# EAGLE design dac single ended 32-2 (EAGLE 4.13)
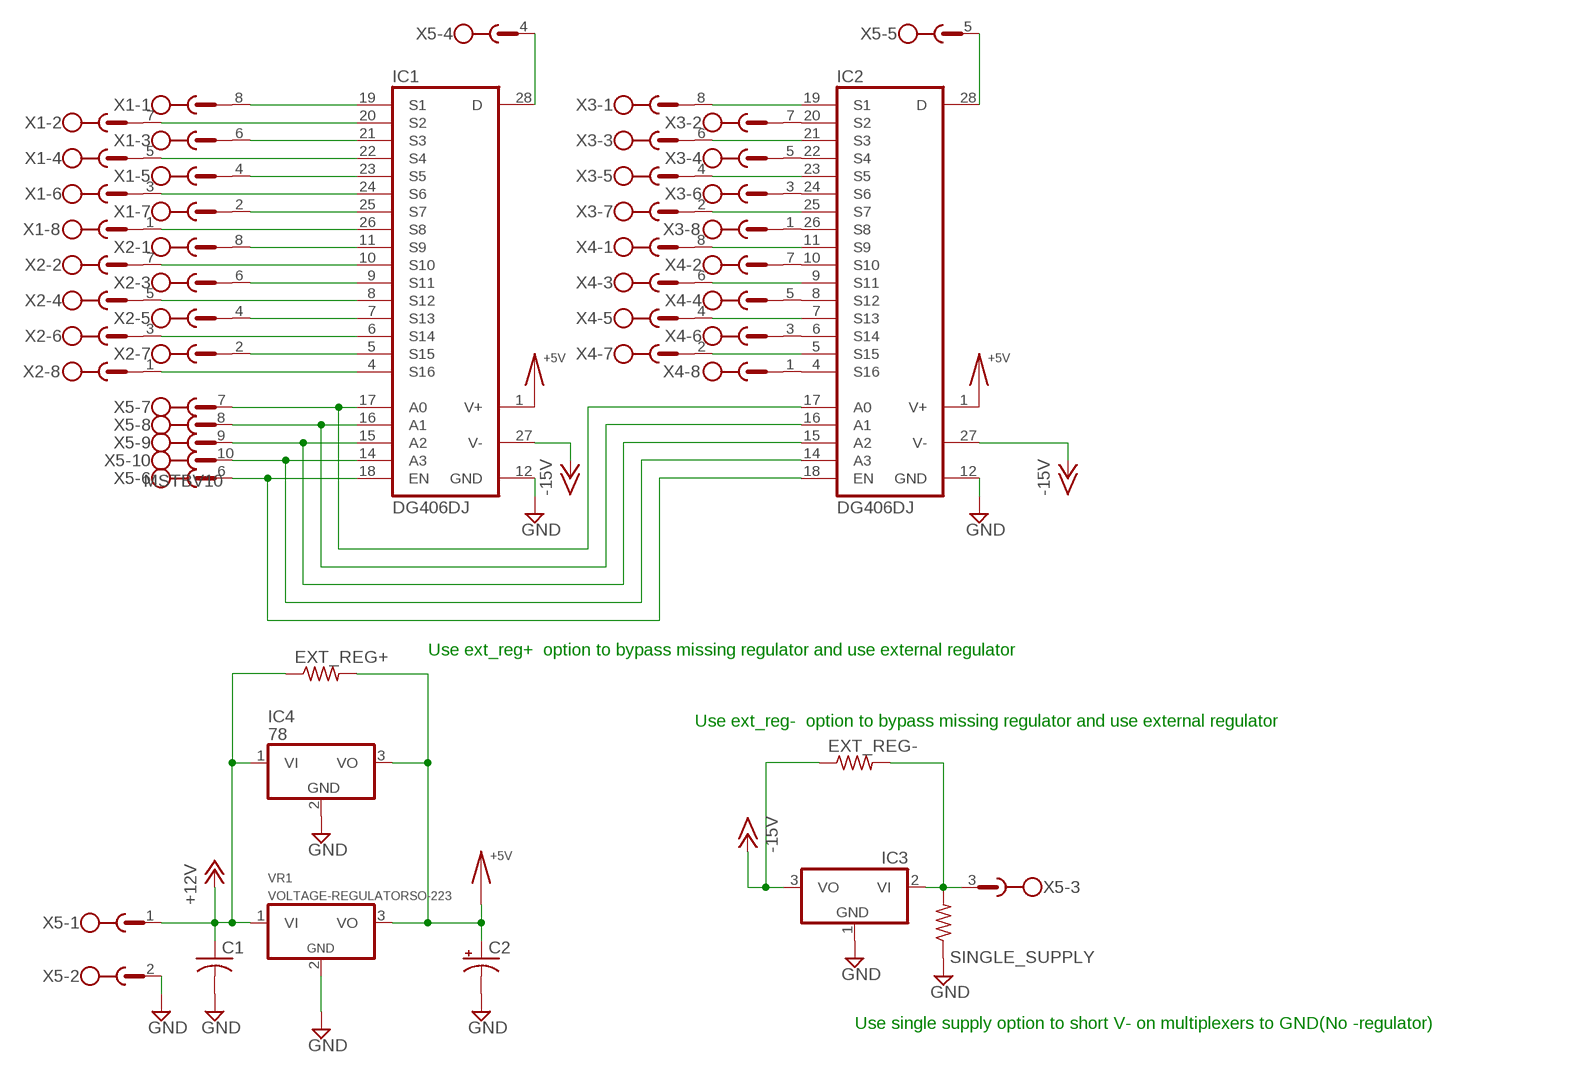
[diagram p0: schematic, sheet 1]

## Parts
C1  CAPACITOR-NO-POLARITYC1210K  [C1210K]
C2  CAPACITOR-ELECTROLYTICG  [PANASONIC_G]
EXT_REG+  RESISITORM1406  [M1406]
EXT_REG-  RESISITORM1406  [M1406]
IC1  DG406DJ  [DIL28-6]
IC2  DG406DJ  [DIL28-6]
IC3  79  [TO220S]
IC4  78  [TO220S]
SINGLE_SUPPLY  RESISITORM1406  [M1406]
VR1  VOLTAGE-REGULATORSO-223  [SOT223R_INFINEON]
X1  MSTBV8  [MSTBV8]
X2  MSTBV8  [MSTBV8]
X3  MSTBV8  [MSTBV8]
X4  MSTBV8  [MSTBV8]
X5  MSTBV10  [MSTBV10]

## Nets
+5V: C2.+ EXT_REG+.2 IC1.1(V+) IC2.1(V+) IC4.3(VO) VR1.3(VO)
+12V: C1.1 EXT_REG+.1 IC4.1(VI) VR1.1(VI) X5.1
-15V: EXT_REG-.1 IC1.27(V-) IC2.27(V-) IC3.3(VO)
GND: C1.2 C2.- IC1.12(GND) IC2.12(GND) IC3.1(GND) IC4.2(GND) SINGLE_SUPPLY.1 VR1.2(GND) X5.2
N$1: IC1.19(S1) X1.8
N$2: IC1.20(S2) X1.7
N$3: IC1.21(S3) X1.6
N$4: IC1.22(S4) X1.5
N$5: IC1.23(S5) X1.4
N$6: IC1.24(S6) X1.3
N$7: IC1.25(S7) X1.2
N$8: IC1.26(S8) X1.1
N$9: IC1.11(S9) X2.8
N$10: IC1.10(S10) X2.7
N$11: IC1.9(S11) X2.6
N$12: IC1.8(S12) X2.5
N$13: IC1.7(S13) X2.4
N$14: IC1.6(S14) X2.3
N$15: IC1.5(S15) X2.2
N$16: IC1.4(S16) X2.1
N$17: IC2.19(S1) X3.8
N$18: IC2.20(S2) X3.7
N$19: IC2.21(S3) X3.6
N$20: IC2.22(S4) X3.5
N$21: IC2.23(S5) X3.4
N$22: IC2.24(S6) X3.3
N$23: IC2.25(S7) X3.2
N$24: IC2.26(S8) X3.1
N$25: IC2.11(S9) X4.8
N$26: IC2.10(S10) X4.7
N$27: IC2.9(S11) X4.6
N$28: IC2.8(S12) X4.5
N$29: IC2.7(S13) X4.4
N$30: IC2.6(S14) X4.3
N$31: IC2.5(S15) X4.2
N$32: IC2.4(S16) X4.1
N$33: IC1.17(A0) IC2.17(A0) X5.7
N$34: IC1.16(A1) IC2.16(A1) X5.8
N$35: IC1.15(A2) IC2.15(A2) X5.9
N$36: IC1.14(A3) IC2.14(A3) X5.10
N$37: IC1.18(EN) IC2.18(EN) X5.6
N$38: IC1.28(D) X5.4
N$39: IC2.28(D) X5.5
N$40: EXT_REG-.2 IC3.2(VI) SINGLE_SUPPLY.2 X5.3

## Notes on the sheet
- Use ext_reg+  option to bypass missing regulator and use external regulator
- Use ext_reg-  option to bypass missing regulator and use external regulator
- Use single supply option to short V- on multiplexers to GND(No -regulator)

## Library data of the parts
C1 = 1 Dan's Common Parts:CAPACITOR-NO-POLARITY: CAPACITOR, American symbol
C2 = 1 Dan's Common Parts:CAPACITOR-ELECTROLYTIC: POLARIZED CAPACITOR, American symbol
EXT_REG+ EXT_REG- SINGLE_SUPPLY = 1 Dan's Common Parts:RESISITOR: RESISTOR, American symbol
IC1 IC2 = maxim:DG406DJ: ANALOG MULTIPLEXER
IC3 = linear:79*: Negative VOLTAGE REGULATOR
IC4 = linear:78*: Positive VOLTAGE REGULATOR
VR1 = 1 Dan's Common Parts:VOLTAGE-REGULATOR: Positive VOLTAGE REGULATOR Source: http://cache.national.com/ds/LM/LM78L05.pdf http://www.fairchildsemi.com/ds/LM/LM7805.pdf
X1-X4 = con-phoenix-500:MSTBV8: PHOENIX
X5 = con-phoenix-508:MSTBV10: PHOENIX

## Board
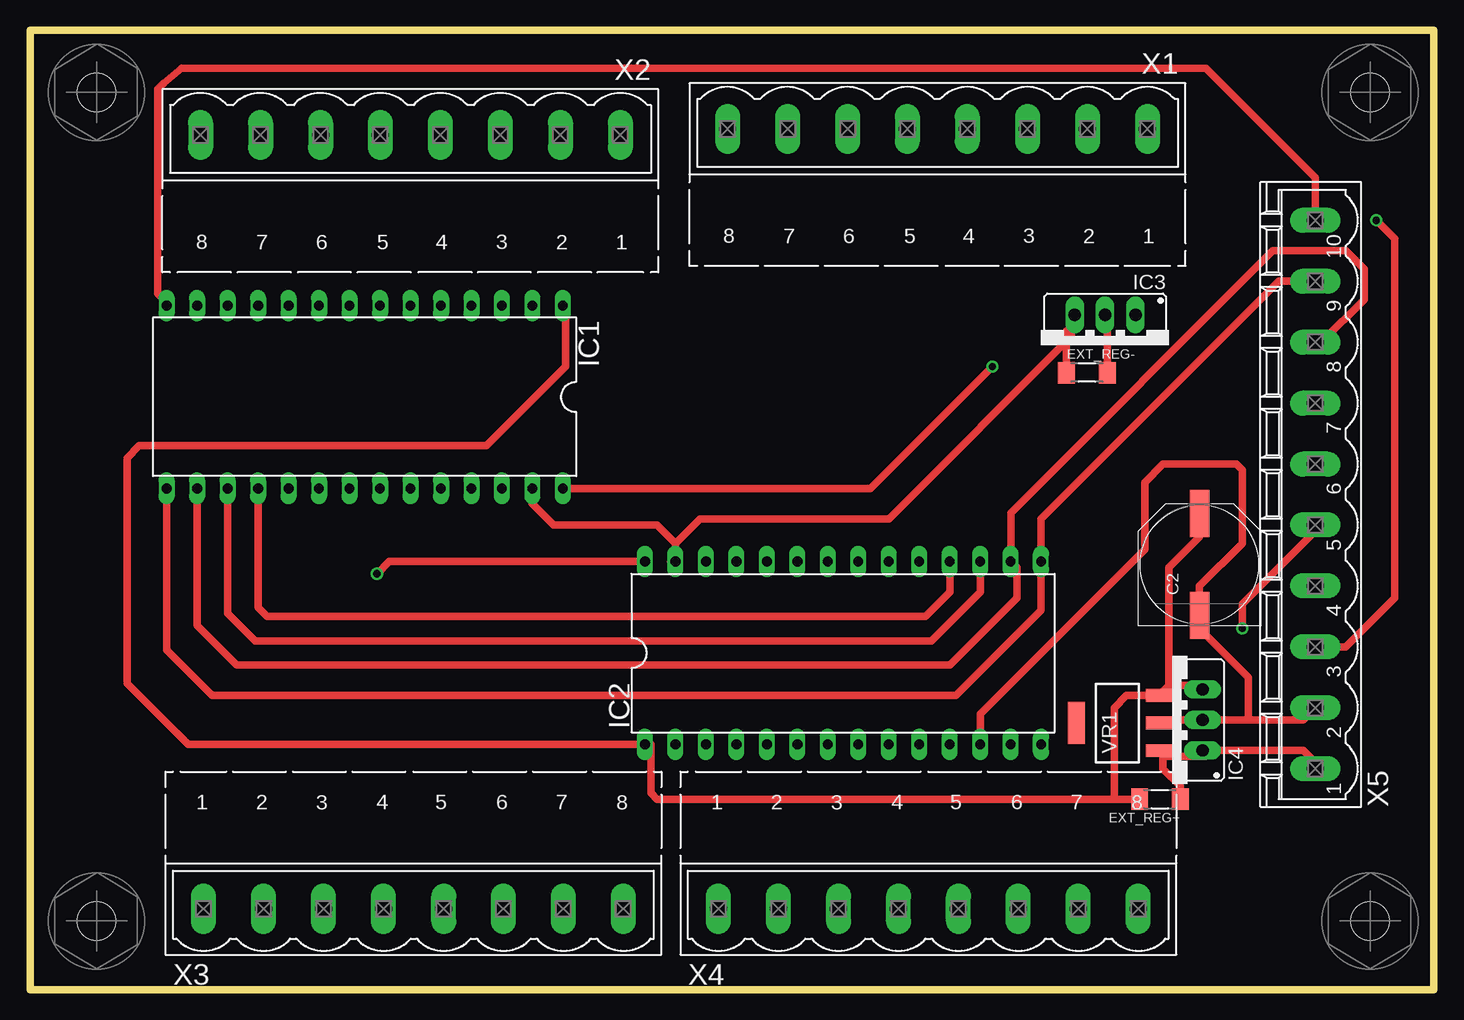
[diagram p1: board, top side]
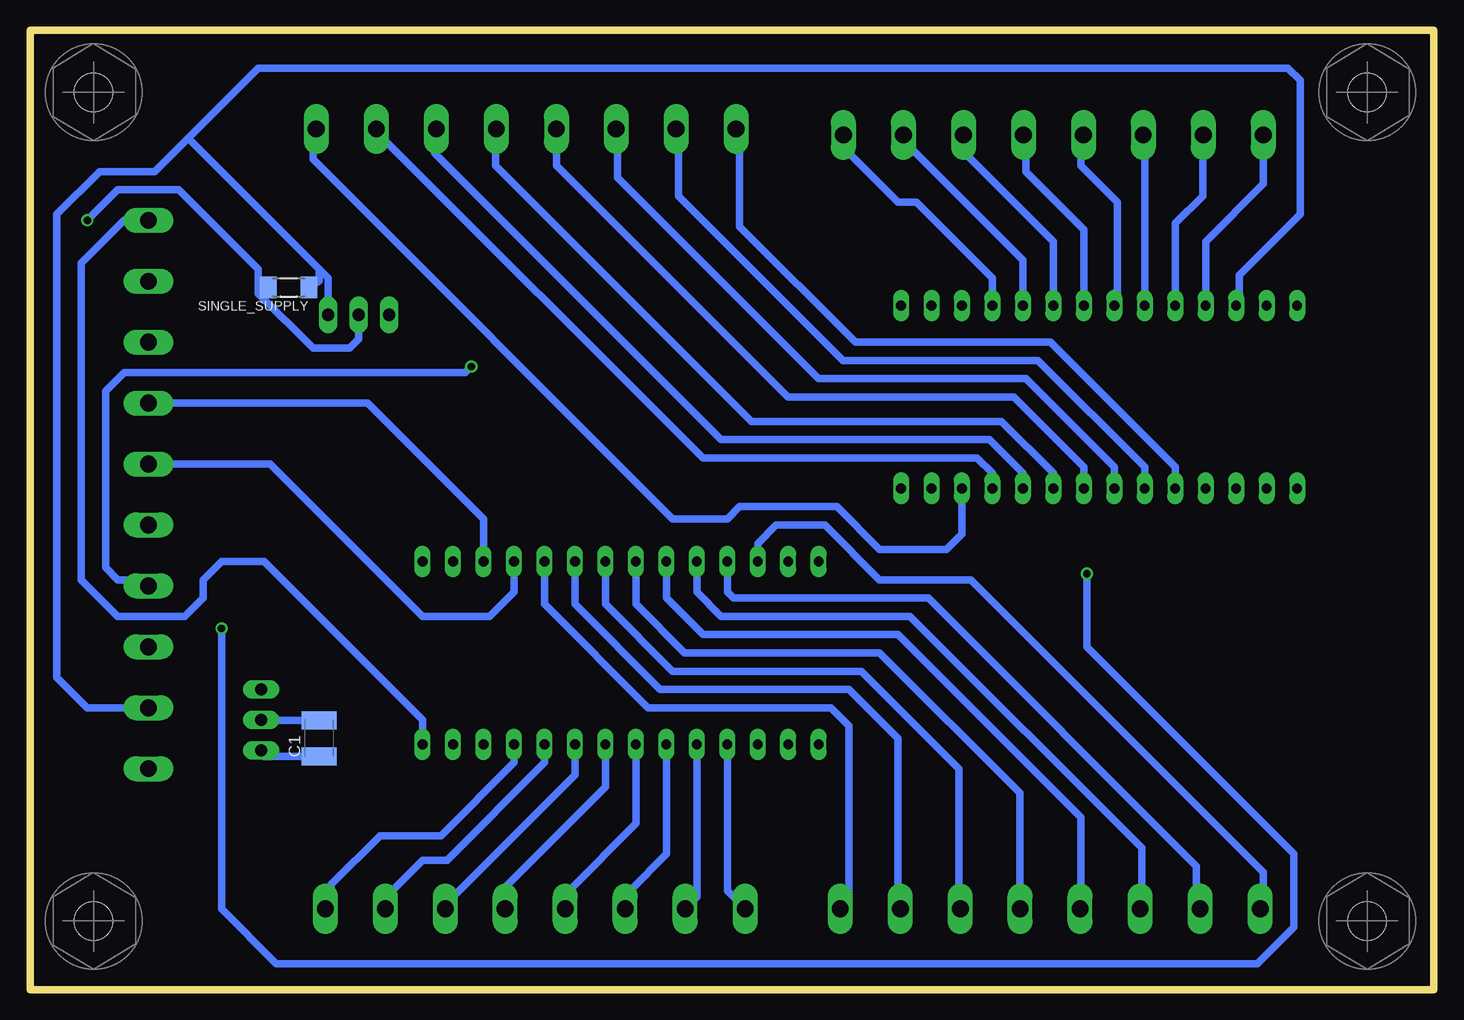
[diagram p2: board, bottom side, seen from below]

Size 117.02 x 80 mm. Coordinates in mm from the lower left corner, seen from the top.
Outline: 0,0 117.02,0 117.02,80 0,80 0,0
Copper layers (1*16): Top 0.035mm / dielectric 1.5mm / Bottom 0.035mm
Design rules "default": minimum track width 20mil, minimum drill 24mil, track to track 15mil, track to pad 15mil, pad to pad 15mil, via to via 15mil, smd to smd 8mil, copper to edge 40mil, drill to drill 8mil, minimum pad ring 10mil, minimum via ring 8mil, stop-mask expansion 4mil, vias tented up to drill 0mil, thermal gap 10mil

### Footprints (pad centres in the part's own frame; a part is rotated, then mirrored left to right if it is on the bottom)
C1210K = smd 1.5 x 2.9: 1 -1.5,0; 2 1.5,0
PANASONIC_G = smd 3.9 x 1.6: + 4.25,0; - -4.25,0
M1406 = smd 1.4 x 1.8: 1 -1.7,0; 2 1.7,0
DIL28-6 = drill 0.813 long: 1 -16.51,-7.62; 2 -13.97,-7.62; 3 -11.43,-7.62; 4 -8.89,-7.62; 5 -6.35,-7.62; 6 -3.81,-7.62; 7 -1.27,-7.62; 8 1.27,-7.62; 9 3.81,-7.62; 10 6.35,-7.62; 11 8.89,-7.62; 12 11.43,-7.62; 13 13.97,-7.62; 14 16.51,-7.62; 15 16.51,7.62; 16 13.97,7.62; 17 11.43,7.62; 18 8.89,7.62; 19 6.35,7.62; 20 3.81,7.62; 21 1.27,7.62; 22 -1.27,7.62; 23 -3.81,7.62; 24 -6.35,7.62; 25 -8.89,7.62; 26 -11.43,7.62; 27 -13.97,7.62; 28 -16.51,7.62
TO220S = drill 1.016 long: 1 -2.54,-2.54; 2 0,-2.54; 3 2.54,-2.54
SCREW = hole 3.2: 0,0
SOT223R_INFINEON = smd 1.067 x 2.184: 1 -2.311,-3.479; 2 0,-3.48; 3 2.312,-3.48 | smd 3.5 x 1.4: 4 0,3.404
MSTBV8 = drill 1.397 long: 1 -17.501,0; 2 -12.497,0; 3 -7.493,0; 4 -2.489,0; 5 2.515,0; 6 7.493,0; 7 12.497,0; 8 17.501,0
MSTBV10 = drill 1.397 long: 1 -22.86,0; 2 -17.78,0; 3 -12.7,0; 4 -7.62,0; 5 -2.54,0; 6 2.54,0; 7 7.62,0; 8 12.7,0; 9 17.78,0; 10 22.86,0

### Placement (x,y rotation side)
C1  92.93,20.95 90 bottom
C2  97.5,35.43 90 top
EXT_REG+  94.2,15.87 180 top
EXT_REG-  88.1,51.43 0 top
IC1  27.9,49.4 180 top
IC2  67.78,28.06 0 top
IC3  89.62,53.72 180 top
IC4  95.21,22.47 90 top
SINGLE_SUPPLY  95.47,58.54 180 bottom
U$1  [SCREW]  5.55,74.8 0 top
U$2  [SCREW]  5.55,5.71 0 top
U$3  [SCREW]  111.72,5.71 0 top
U$4  [SCREW]  111.72,74.8 0 top
VR1  90.64,22.22 90 top
X1  75.65,71.75 180 top
X2  31.71,71.24 180 top
X3  31.97,6.73 0 top
X4  74.89,6.73 0 top
X5  107.15,41.27 90 top

### Tracks (layer width: path | path; a pad name or v marks a point on that pad's centre or on a via)
+5V
  Top 0.61: 94.96,25.37 VR1.3 94.09,24.51 91.4,24.51 90.39,23.49 90.39,15.87 | 94.96,25.37 94.96,35.17 97.5,37.71 C2.+ 97.5,39.75 | 90.39,15.87 52.29,15.87 51.78,16.38 51.78,20.44 IC2.1 13.17,20.44 8.09,25.52 8.09,44.32 9.11,45.33 38.06,45.33 44.67,51.94 44.67,57.02 IC1.1 | 90.39,15.87 EXT_REG+.2 | IC4.3 98.01,25.01 97.65,25.37 94.96,25.37
+12V
  Top 0.61: 98.51,19.93 IC4.1 | 98.51,19.93 98.01,19.43 94.6,19.43 VR1.1 94.42,19.91 94.45,19.93 94.45,18.41 95.9,16.96 EXT_REG+.1 | X5.1 107.66,18.41 106.13,19.93 98.51,19.93
  Bottom 0.61: IC4.1 98.01,19.93 97.52,19.45 C1.1
-15V
  Top 0.406: IC2.27 53.3,35.68 53.81,36.19 53.81,37.21 | 86.83,57.02 IC3.3 87.34,57.02 86.4,54.91
  Top 0.61: IC1.27 41.87,40.51 43.65,38.73 52.29,38.73 53.81,37.21 | 53.81,37.21 IC2.27 | 53.81,37.21 55.84,39.24 71.59,39.24 86.83,54.48 86.83,57.02 | 86.4,54.91 EXT_REG-.1
GND
  Top 0.61: IC2.12 79.21,22.98 92.93,36.7 92.93,42.29 94.45,43.81 100.55,43.81 101.05,43.3 101.05,37.21 97.5,33.65 C2.- 97.5,30.09 101.56,26.03 101.56,22.47 | VR1.2 94.37,22.47 IC4.2 101.56,22.47 | 101.56,22.47 106.13,22.47 X5.2
  Bottom 0.61: 103.85,70.99 98.01,76.83 12.15,76.83 11.14,75.81 11.14,64.64 16.22,59.56 16.22,57.27 IC1.12 | 103.85,70.99 106.64,68.19 111.21,68.19 114.77,64.64 114.77,26.03 112.23,23.49 X5.2 | IC3.1 92.16,59.3 92.93,60.07 | 103.85,70.99 92.93,60.07 | IC4.2 98.01,22.47 97.98,22.45 C1.2 | SINGLE_SUPPLY.1 92.93,59.05 92.93,60.07
N$1
  Bottom 0.61: IC1.19 21.55,43.56 31.97,53.97 48.22,53.97 57.87,63.62 57.87,71.24 58.38,71.75 X1.8
N$2
  Bottom 0.61: IC1.20 24.09,43.56 32.98,52.45 49.24,52.45 62.95,66.16 62.95,71.75 X1.7
N$3
  Bottom 0.61: IC1.21 26.63,43.56 34,50.92 51.27,50.92 68.03,67.69 68.03,71.75 X1.6
N$4
  Bottom 0.61: IC1.22 29.17,43.56 35.01,49.4 53.81,49.4 73.11,68.7 73.11,71.75 X1.5
N$5
  Bottom 0.61: IC1.23 31.71,43.05 36.03,47.37 56.86,47.37 78.19,68.7 78.19,72.26 77.69,71.75 X1.4
N$6
  Bottom 0.61: IC1.24 34.25,43.05 37.05,45.84 59.4,45.84 83.27,69.72 83.27,71.75 X1.3
N$7
  Bottom 0.61: IC1.25 36.79,43.05 38.06,44.32 60.92,44.32 88.35,71.75 X1.2
N$8
  Bottom 0.61: IC1.26 39.33,37.97 40.6,36.7 46.19,36.7 49.75,40.25 57.87,40.25 58.89,39.24 63.46,39.24 93.43,69.21 93.43,71.24 92.93,71.75 X1.1
N$9
  Bottom 0.61: IC1.11 19.01,62.35 14.19,67.18 14.19,71.24 X2.8
N$10
  Bottom 0.61: IC1.10 21.55,63.88 19.27,66.16 19.27,71.24 | 19.27,71.24 19.27,71.75 | 19.27,71.24 X2.7
N$11
  Bottom 0.61: IC1.9 24.09,69.46 24.35,70.23 24.35,71.75 23.84,71.24 X2.6
N$12
  Bottom 0.61: X2.5 28.92,71.24 29.68,70.48 29.43,71.24 29.43,68.7 26.38,65.65 26.38,57.27 IC1.8
N$13
  Bottom 0.61: 34,71.24 X2.4 34.51,71.24 34,70.73 34,68.19 29.17,63.37 IC1.7
N$14
  Bottom 0.61: 39.59,70.73 39.08,71.24 X2.3 39.59,71.24 39.08,70.73 39.08,69.72 31.71,62.35 IC1.6
N$15
  Bottom 0.61: IC1.5 34.25,60.83 44.16,70.73 44.16,71.24 X2.2
N$16
  Bottom 0.61: IC1.4 36.79,59.3 43.14,65.65 44.67,65.65 49.24,70.23 49.24,71.24 X2.1
N$17
  Bottom 0.61: IC2.19 74.13,32.13 65.49,23.49 50.25,23.49 48.73,21.97 48.73,7.74 49.75,6.73 X3.8
N$18
  Bottom 0.61: IC2.20 71.59,32.13 64.48,25.01 48.73,25.01 44.67,20.95 44.67,6.22 44.16,6.73 X3.7
N$19
  Bottom 0.61: IC2.21 69.05,32.13 63.46,26.54 47.71,26.54 39.59,18.41 39.59,7.23 39.08,6.73 X3.6
N$20
  Bottom 0.61: IC2.22 66.51,32.13 62.45,28.06 46.19,28.06 34.51,16.38 34.51,6.73 X3.5
N$21
  Bottom 0.61: IC2.23 63.97,32.63 60.92,29.59 44.67,29.59 29.43,14.35 29.43,7.23 28.92,6.73 X3.4
N$22
  Bottom 0.61: IC2.24 61.43,33.14 59.4,31.11 43.65,31.11 24.35,11.81 24.35,7.23 24.85,6.73 X3.3
N$23
  Bottom 0.61: IC2.25 58.89,33.14 58.38,32.63 42.13,32.63 19.77,10.28 19.77,7.23 19.27,6.73 X3.2
N$24
  Bottom 0.61: IC2.26 56.35,37.21 54.83,38.73 50.76,38.73 46.19,34.16 38.57,34.16 14.19,9.77 14.19,6.73 14.69,6.22 14.69,6.73 X3.1
N$25
  Bottom 0.61: IC2.11 76.67,18.92 82.77,12.82 87.85,12.82 91.91,8.76 91.91,7.23 92.42,6.73 X4.8
N$26
  Bottom 0.61: IC2.10 74.13,18.92 82.26,10.79 84.29,10.79 87.34,7.74 87.34,6.73 X4.7
N$27
  Bottom 0.61: X4.6 82.77,6.73 71.59,17.9 IC2.9
N$28
  Bottom 0.61: IC2.8 69.05,16.89 77.69,8.25 77.69,6.73 X4.5
N$29
  Bottom 0.61: IC2.7 66.51,13.84 72.1,8.25 72.1,7.23 72.61,6.73 X4.4
N$30
  Bottom 0.61: IC2.6 63.97,11.3 67.02,8.25 67.02,7.23 67.53,6.73 X4.3
N$31
  Bottom 0.61: X4.2 62.45,6.73 61.43,7.74 IC2.5
N$32
  Bottom 0.61: X4.1 57.37,6.73 58.89,8.25 IC2.4
N$33
  Top 0.61: IC1.17 16.47,31.36 18.76,29.08 75.15,29.08 79.21,33.14 IC2.17
  Bottom 0.61: IC2.17 79.21,39.24 88.86,48.89 X5.7
N$34
  Top 0.61: IC1.16 13.93,30.35 17.23,27.05 76.67,27.05 82.26,32.63 82.26,35.17 IC2.16 81.75,39.75 103.59,61.59 109.69,61.59 111.21,60.07 111.21,57.53 107.66,53.97 X5.8
N$35
  Top 0.61: IC1.15 11.39,28.32 15.2,24.51 77.18,24.51 84.29,31.62 IC2.15 84.29,39.24 104.1,59.05 X5.9 107.66,59.05
N$36
  Top 0.61: X5.10 107.15,67.69 98.01,76.83 12.66,76.83 11.14,75.56 10.63,75.05 10.63,58.03 11.65,57.02 IC1.14
  Bottom 0.406: 108.17,64.64 107.66,64.64 X5.10
  Bottom 0.61: 108.17,64.64 109.18,64.13 112.74,60.57 112.74,34.16 109.69,31.11 104.1,31.11 102.58,32.63 102.58,34.16 101.05,35.68 97.5,35.68 84.29,22.47 IC2.14
N$37
  Top 0.61: IC1.18 19.01,31.87 19.77,31.11 74.64,31.11 76.67,33.14 IC2.18
  Bottom 0.61: X5.6 96.99,43.81 84.29,31.11 78.7,31.11 76.67,33.14 IC2.18
N$38  (via drill 0.6)
  Top 0.61: IC1.28 70.07,41.78 v80.23,51.94
  Bottom 0.61: v80.23,51.94 80.73,51.43 109.18,51.43 110.71,49.91 110.71,35.17 109.69,34.16 107.66,34.16 X5.4
N$39  (via drill 0.6)
  Top 0.61: IC2.28 29.93,35.68 v28.92,34.67 | X5.5 107.15,38.22 101.05,32.13 v101.05,30.09
  Bottom 0.61: v28.92,34.67 28.92,28.57 11.65,11.3 11.65,5.2 14.69,2.15 96.48,2.15 101.05,6.73 v101.05,30.09
N$40  (via drill 0.6)
  Top 0.406: IC3.2 89.37,57.02
  Top 0.61: EXT_REG-.2 89.8,55.92 89.37,57.02 | v112.23,64.13 113.75,62.61 113.75,32.63 109.69,28.57 X5.3
  Bottom 0.61: IC3.2 89.62,54.22 90.39,53.46 93.43,53.46 98.01,58.03 98.01,59.05 | v112.23,64.13 109.69,66.67 104.61,66.67 98.01,60.07 98.01,59.05 | SINGLE_SUPPLY.2 97.5,58.54 98.01,59.05